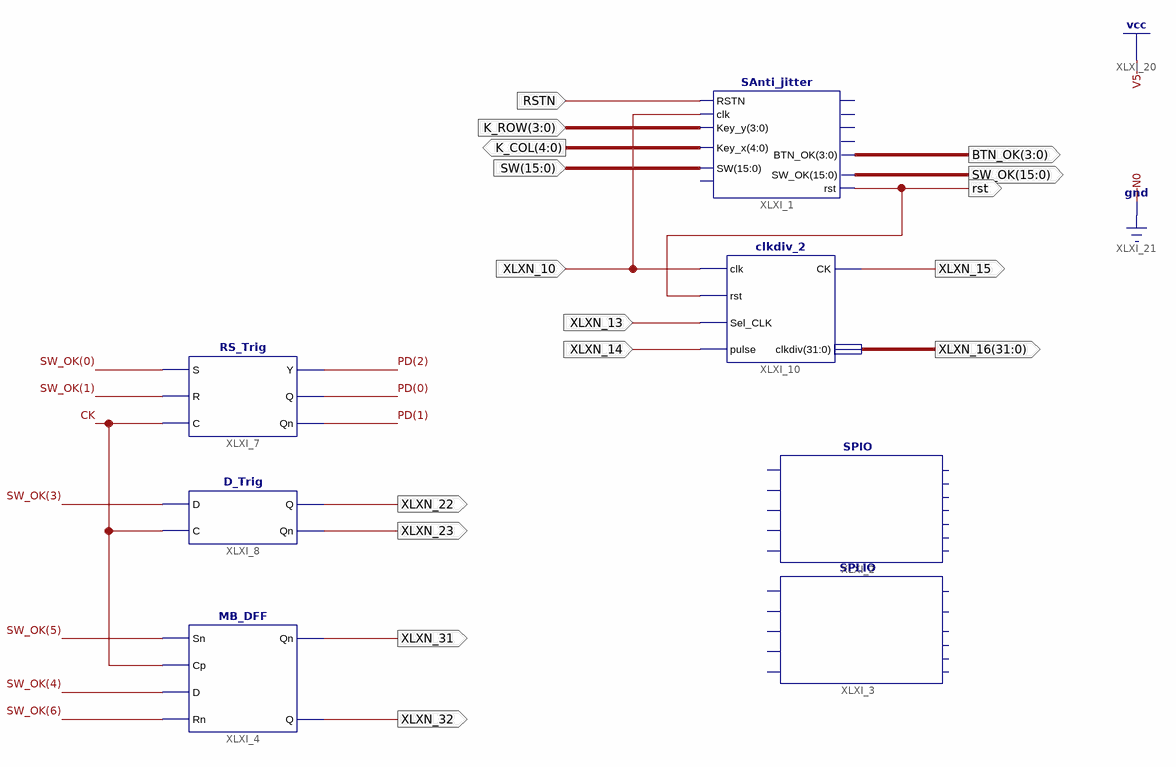
[diagram p0: schematic sheet 1]
// Xilinx ISE schematic Top_Trigger.sch (kintex7) as structural Verilog: 7 symbols, 16 ports
module Top_Trigger (
  input  RSTN,
  input  [15:0] SW,
  input  [3:0] K_ROW,
  input  XLXN_10,
  input  XLXN_13,
  input  XLXN_14,
  output rst,
  output [4:0] K_COL,
  output [3:0] BTN_OK,
  output [15:0] SW_OK,
  output XLXN_15,
  output [31:0] XLXN_16,
  output XLXN_22,
  output XLXN_23,
  output XLXN_31,
  output XLXN_32
);

  wire CK;
  wire [2:0] PD;

  SAnti_jitter XLXI_1 (
    .SW(SW), .Key_y(K_ROW), .Key_x(K_COL), .RSTN(RSTN), .clk(XLXN_10), .rst(rst), .SW_OK(SW_OK),
    .BTN_OK(BTN_OK));  // open: readn, Key_out, Key_ready, CR, pulse_out
  clkdiv_2 XLXI_10 (.clk(XLXN_10), .rst(rst), .Sel_CLK(XLXN_13), .pulse(XLXN_14), .CK(XLXN_15), .clkdiv(XLXN_16));
  MB_DFF XLXI_4 (.Sn(SW_OK[5]), .Cp(CK), .D(SW_OK[4]), .Rn(SW_OK[6]), .Qn(XLXN_31), .Q(XLXN_32));
  SPLIO XLXI_3 ();  // open: clk, P_Data, rst, EN, Start, led_clk, led_clrn, LED_PEN, led_sout, LED, GPIOf0
  SPIO XLXI_2 ();  // open: clk, P_Data, rst, EN, Start, led_clk, GPIOf0, LED_out, counter_set, led_clrn, LED_PEN, led_sout
  RS_Trig XLXI_7 (.S(SW_OK[0]), .R(SW_OK[1]), .C(CK), .Y(PD[2]), .Q(PD[0]), .Qn(PD[1]));
  D_Trig XLXI_8 (.D(SW_OK[3]), .C(CK), .Q(XLXN_22), .Qn(XLXN_23));
endmodule
